# Altium project Power_Merge_Board.PrjPCB
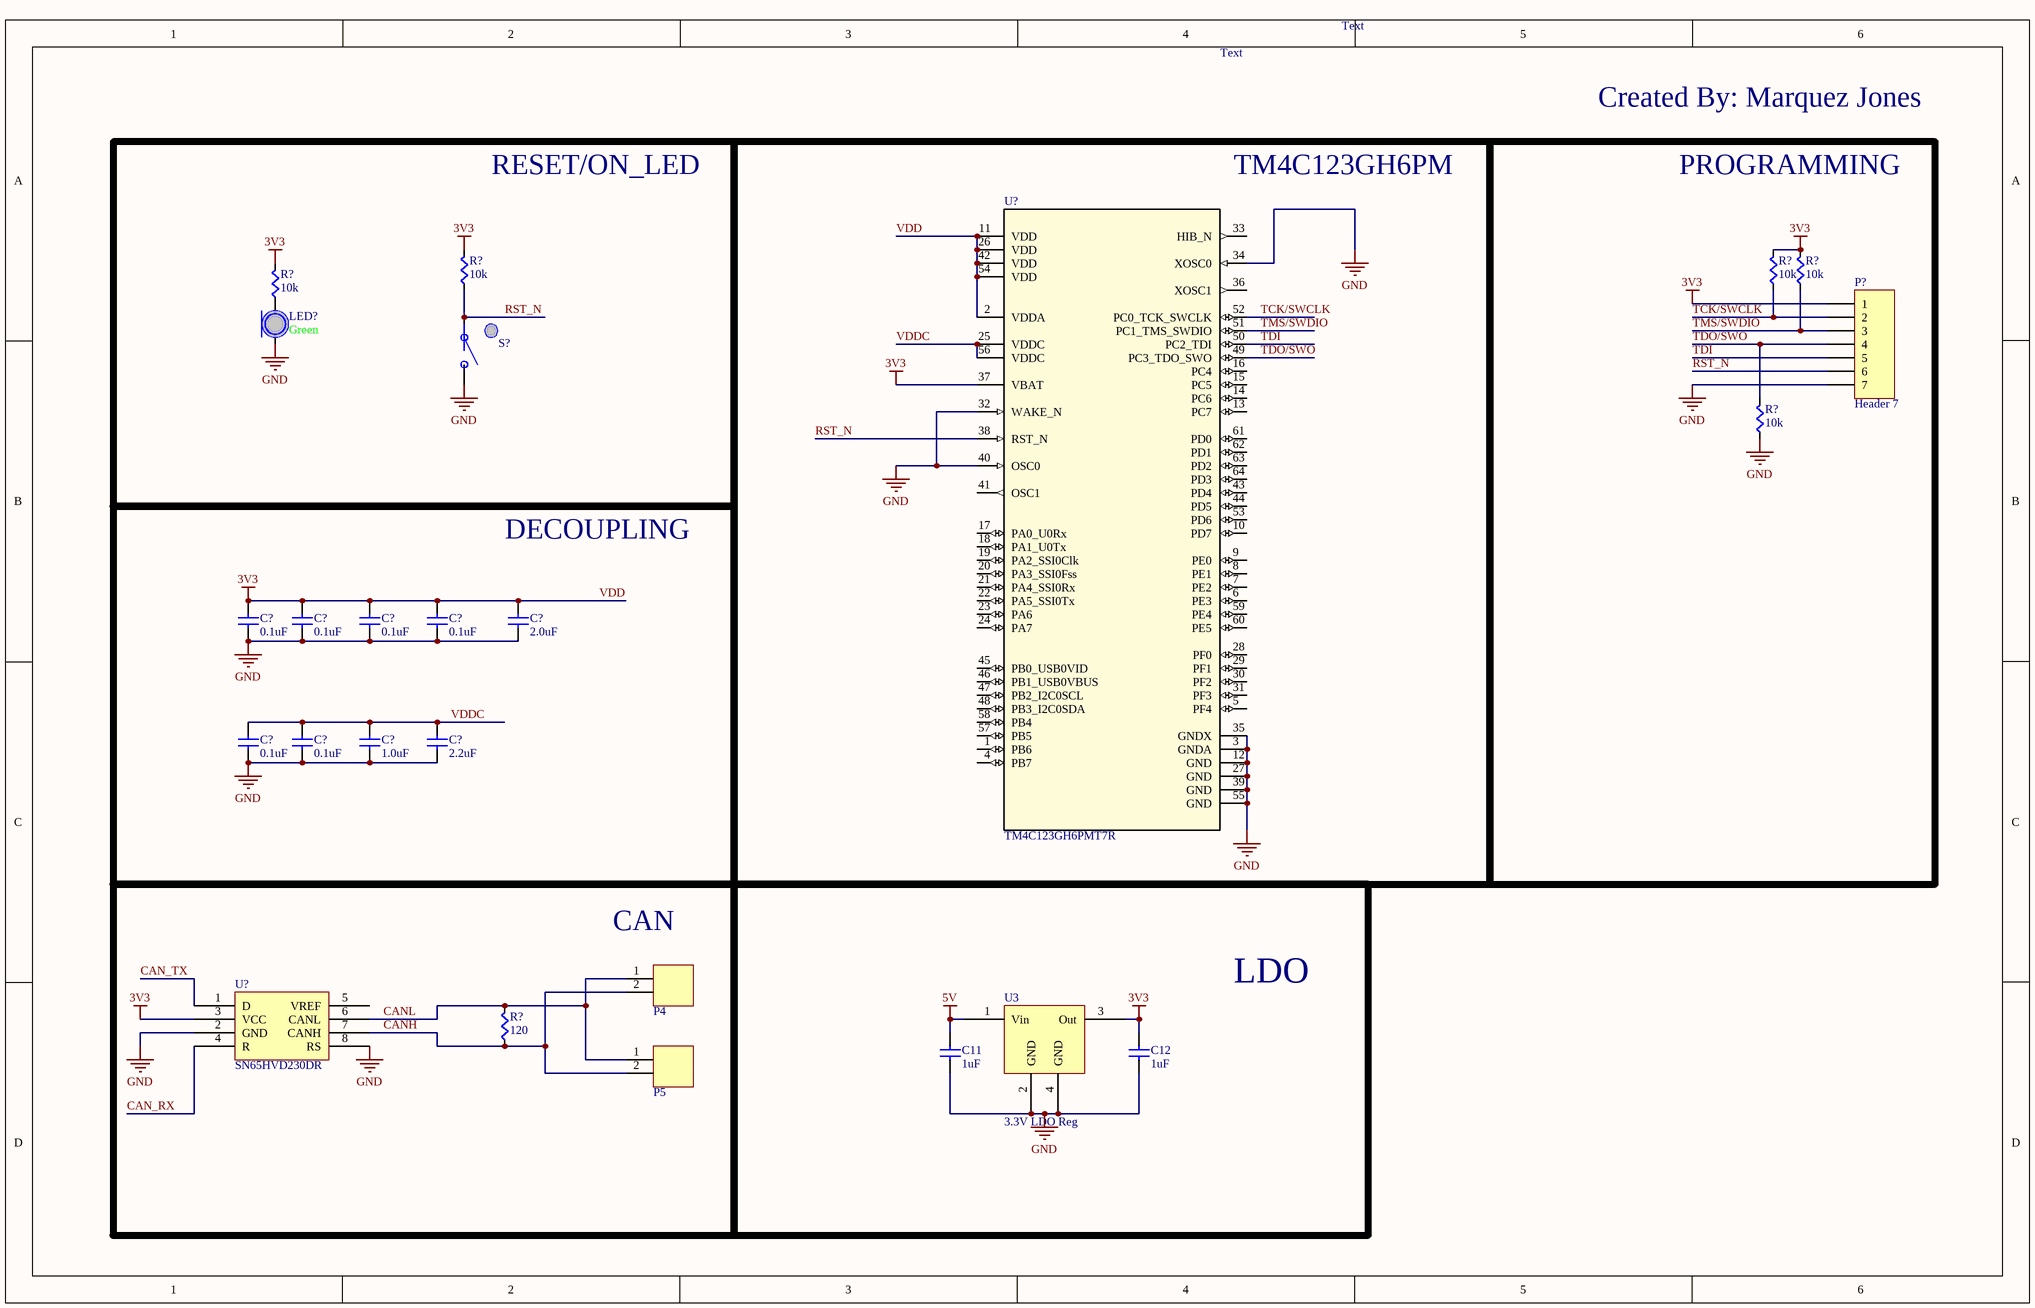
[diagram p0: Tiva_C_Base.SchDoc]
3 sheets, 56 parts. Net scope: global (net labels, ports and power ports of the same name join across sheets).
Board file: Power_Merge_Board.PcbDoc
Sheets:
  Tiva_C_Base.SchDoc
  BQ7930_Schem.SchDoc
  Power_Merge_Sys.SchDoc

## Sheet Tiva_C_Base.SchDoc
size B

### Parts
(Parts that share a designator on the sheet are numbered #1, #2 ... from top to bottom, then left to right.)
C11  value 1uF  [CAPC0603]  (hidden comment: Cap)
C12  value 1uF  [CAPC0603]  (hidden comment: Cap)
C?#1  value 0.1uF  [CAPC0603]  (hidden comment: Cap)
C?#2  value 0.1uF  [CAPC0603]  (hidden comment: Cap)
C?#3  value 0.1uF  [CAPC0603]  (hidden comment: Cap)
C?#4  value 0.1uF  [CAPC0603]  (hidden comment: Cap)
C?#5  value 2.0uF  [CAPC0603]  (hidden comment: Cap)
C?#6  value 0.1uF  [CAPC0603]  (hidden comment: Cap)
C?#7  value 0.1uF  [CAPC0603]  (hidden comment: Cap)
C?#8  value 1.0uF  [CAPC0603]  (hidden comment: Cap)
C?#9  value 2.2uF  [CAPC0603]  (hidden comment: Cap)
LED?  Color: Green  [LED0603]  (hidden comment: LED)
P4  2-pin Horz Sherlock  [MOLEX-HDR-1X2-SHERLOCK-HORZ]  (value not drawn)
P5  2-pin Horz Sherlock  [MOLEX-HDR-1X2-SHERLOCK-HORZ]  (value not drawn)
P?  Header 7  [HDR1X7]
R?#1  value 10k  [RES0603]  (hidden comment: Res)
R?#2  value 10k  [RES0603]  (hidden comment: Res)
R?#3  value 10k  [RES0603]  (hidden comment: Res)
R?#4  value 10k  [RES0603]  (hidden comment: Res)
R?#5  value 10k  [RES0603]  (hidden comment: Res)
R?#6  value 120  [RES0603]  (hidden comment: Res)
S?  Button  [PTS645xxxxSMTR92]  (value not drawn)
U3#1  3.3V LDO Reg  [SOT23-4n]
U?#1  TM4C123GH6PMT7R  [PM0064A_N]
U?#2  SN65HVD230DR  [SOIC-8pin]

### Blocks framed on the sheet
RESET/ON_LED: LED? R?#1 R?#4 S?
TM4C123GH6PM: U?#1
PROGRAMMING: P? R?#2 R?#3 R?#5
DECOUPLING: C?#1-C?#9
CAN: P4 P5 R?#6 U?#2
LDO: C11 C12 U3#1

### Nets
5V: C11.1(A) U3#1.1(Vin)
GND: C11.2(B) C12.2(B) C?#1.2(B) C?#2.2(B) C?#3.2(B) C?#4.2(B) C?#5.2(B) C?#6.2(B) C?#7.2(B) C?#8.2(B) C?#9.2(B) LED?.C P?.7 R?#5.2(B) S?.B U3#1.2(GND) U3#1.4(GND) U?#1.3(GNDA) U?#1.12(GND) U?#1.27(GND) U?#1.32(WAKE_N) U?#1.34(XOSC0) U?#1.35(GNDX) U?#1.39(GND) U?#1.40(OSC0) U?#1.55(GND) U?#2.2(GND) U?#2.8(RS)
VDD: C12.1(A) C?#1.1(A) C?#2.1(A) C?#3.1(A) C?#4.1(A) C?#5.1(A) P?.1 R?#1.1(A) R?#2.1(A) R?#3.1(A) R?#4.1(A) U3#1.3(Out) U?#1.2(VDDA) U?#1.11(VDD) U?#1.26(VDD) U?#1.37(VBAT) U?#1.42(VDD) U?#1.54(VDD) U?#2.3(VCC)  [also labelled 3V3]
CAN_RX: U?#2.4(R)
CAN_TX: U?#2.1(D)
CANH: P4.2 P5.2 R?#6.2(B) U?#2.7(CANH)
CANL: P4.1 P5.1 R?#6.1(A) U?#2.6(CANL)
RST_N: P?.6 R?#1.2(B) S?.A U?#1.38(RST_N)
TCK/SWCLK: P?.2 R?#2.2(B) U?#1.52(PC0_TCK_SWCLK)
TDI: P?.5 U?#1.50(PC2_TDI)
TDO/SWO: P?.4 R?#5.1(A) U?#1.49(PC3_TDO_SWO)
TMS/SWDIO: P?.3 R?#3.2(B) U?#1.51(PC1_TMS_SWDIO)
VDDC: C?#6.1(A) C?#7.1(A) C?#8.1(A) C?#9.1(A) U?#1.25(VDDC) U?#1.56(VDDC)
NetLED?_A: LED?.A R?#4.2(B)

Not connected (* = marked no-connect by the designer): U?#1 1(PB6) 4(PB7) 5(PF4) 6(PE3) 7(PE2) 8(PE1) 9(PE0) 10(PD7) 13(PC7) 14(PC6) 15(PC5) 16(PC4) 17(PA0_U0Rx) 18(PA1_U0Tx) 19(PA2_SSI0Clk) 20(PA3_SSI0Fss) 21(PA4_SSI0Rx) 22(PA5_SSI0Tx) 23(PA6) 24(PA7) 28(PF0) 29(PF1) 30(PF2) 31(PF3) 33(HIB_N) 36(XOSC1) 41(OSC1) 43(PD4) 44(PD5) 45(PB0_USB0VID) 46(PB1_USB0VBUS) 47(PB2_I2C0SCL) 48(PB3_I2C0SDA) 53(PD6) 57(PB5) 58(PB4) 59(PE4) 60(PE5) 61(PD0) 62(PD1) 63(PD2) 64(PD3); U?#2 5(VREF)

### Notes on the sheet
- Text
- Created By: Marquez Jones

### Library data of the parts
C11 C12 = Cap: Manufacturer Part Number: C0603C105K8PACTU; Supplier 1: Digi-Key; Supplier Part Number 1: 399-3118-1-ND
P4 P5 = MOLEX-HDR-1x2-SHERLOCK_RA: Header, Molex, 2mm Pitch Sherlock Header, Single Row, Horizontal, 2 Circuits, Length 3.3mm,  0353630260; Manufacturer: Molex Inc; Manufacturer Part Number: 0353630260; Supplier Part Number 1: WM18931-ND; Supplier 1: Digi-Key
P? = Header 7: Header, 7-Pin; LatestRevisionDate: 17-Jul-2002; LatestRevisionNote: Re-released for DXP Platform.; Publisher: Altium Limited
S? = Button: SPST Button; Supplier 1: Digi-Key; Supplier Part Number 1: CKN9087CT-ND
U3#1 = LM3940IMPX-3.3: IC REG LDO 3.3V 1A SOT223; Supplier 1: Digi-Key; Supplier Part Number 1: LM3940IMPX-3.3/NOPBCT-ND
U?#1 = TM4C123GH6PMT7R: Imported; PartNumber: TM4C123GH6PMTR; Manufacturer: Texas Instruments; CompType: IC; PIN_COUNT: 64; Application_BuildNumber: *; Alternate_PartNumber: TM4C123GH6PMT; PackageReference: PM0064A; MountType: SMT; RoHS: Y; RefDes: RefDes; TYPE: TYPE; Value: Value
U?#2 = SN65HVD230DR: IC TXRX CAN 1MBPS 3.3V 8SOIC; Supplier 1: Digi-Key; Supplier Part Numbe 1: 296-11654-1-ND
C?#1-C?#9 = Cap: Supplier 1: Digi-Key; Supplier Part Number 1: 1276-1000-1-ND
LED? = LED: Supplier 1: Digi-Key; Supplier Part Number 1: 754-1122-1-ND
R?#1-R?#6 = Res: Supplier 1: Digi-Key; Supplier Part Number 1: RMCF0603JT10K0CT-ND

## Sheet BQ7930_Schem.SchDoc
size C
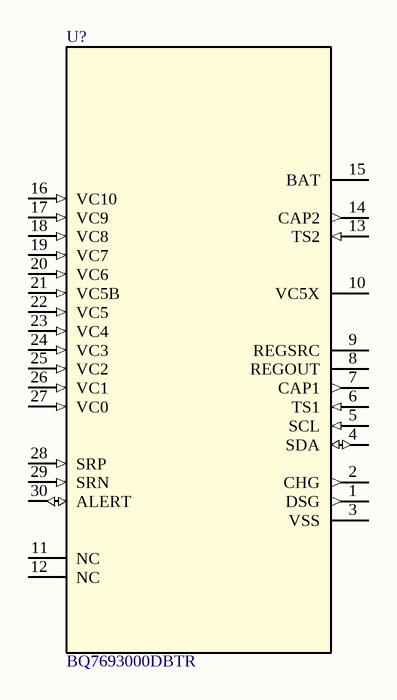
[diagram p1: BQ7930_Schem.SchDoc]

### Parts
(Parts that share a designator on the sheet are numbered #1, #2 ... from top to bottom, then left to right.)
U?#3  BQ7693000DBTR  [DBT0030A_N]

### Nets

Not connected (* = marked no-connect by the designer): U?#3 1(DSG) 2(CHG) 3(VSS) 4(SDA) 5(SCL) 6(TS1) 7(CAP1) 8(REGOUT) 9(REGSRC) 10(VC5X) 11(NC) 12(NC) 13(TS2) 14(CAP2) 15(BAT) 16(VC10) 17(VC9) 18(VC8) 19(VC7) 20(VC6) 21(VC5B) 22(VC5) 23(VC4) 24(VC3) 25(VC2) 26(VC1) 27(VC0) 28(SRP) 29(SRN) 30(ALERT)

### Library data of the parts
U?#3 = BQ7693000DBTR: Imported; Manufacturer: Texas Instruments; PartNumber: BQ7693000DBTR; RefDes: RefDes; TYPE: TYPE; Value: Value

## Sheet Power_Merge_Sys.SchDoc
size C
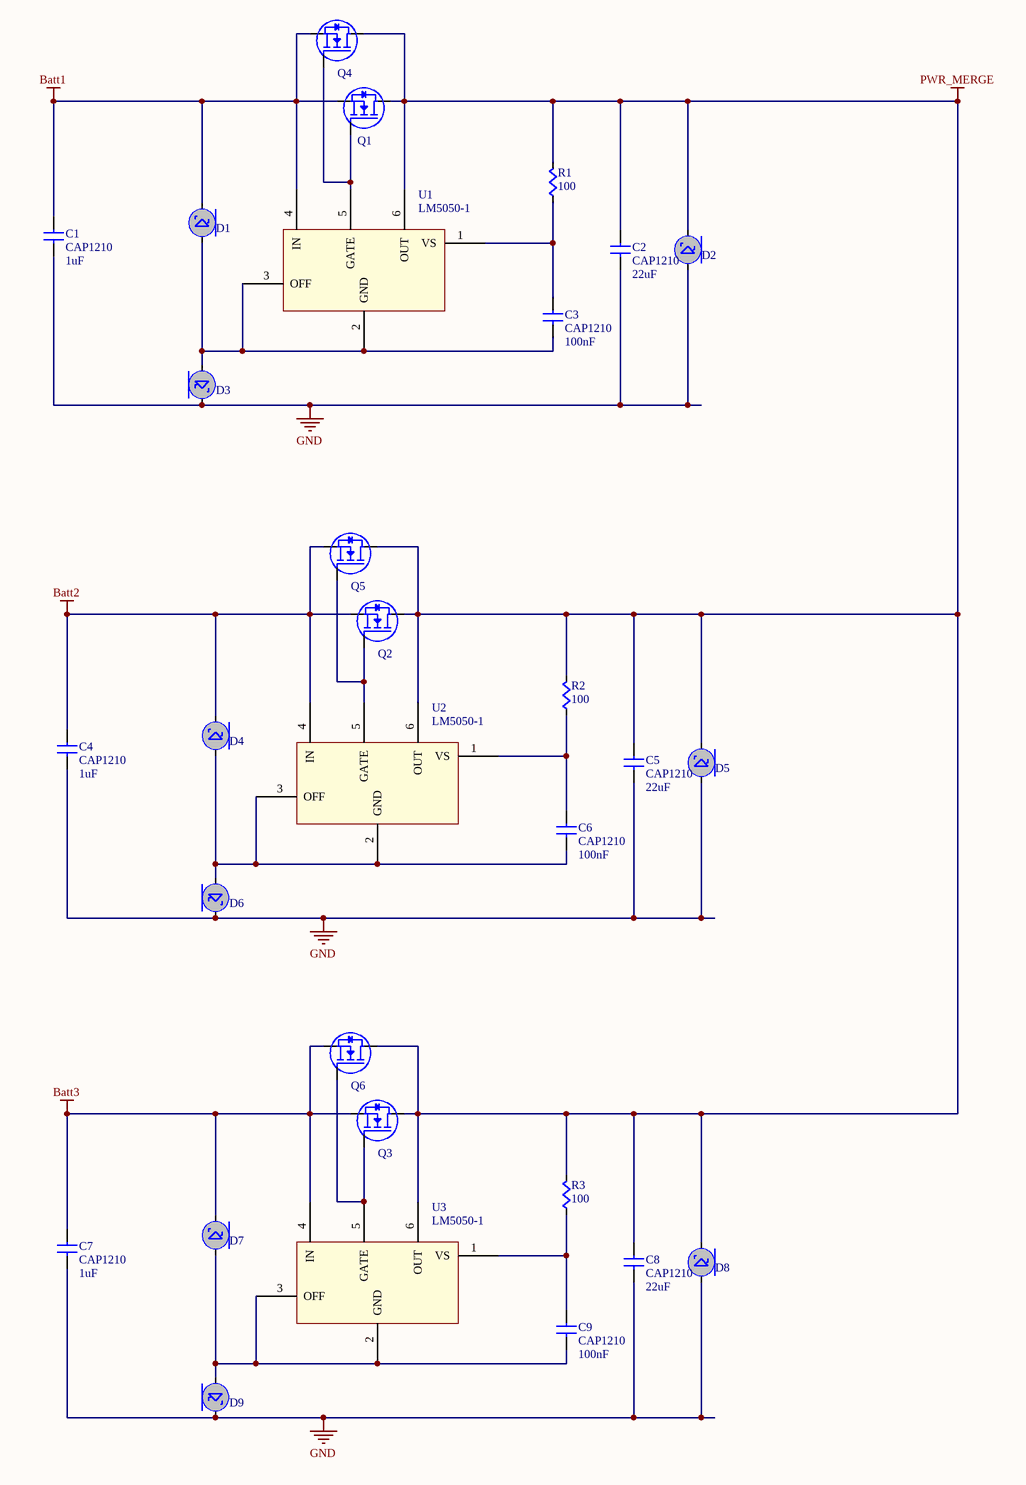
[diagram p2: Power_Merge_Sys.SchDoc]

### Parts
(Parts that share a designator on the sheet are numbered #1, #2 ... from top to bottom, then left to right.)
C1  CAP1210  value 1uF  [CAP1210]
C2  CAP1210  value 22uF  [CAP1210]
C3  CAP1210  value 100nF  [CAP1210]
C4  CAP1210  value 1uF  [CAP1210]
C5  CAP1210  value 22uF  [CAP1210]
C6  CAP1210  value 100nF  [CAP1210]
C7  CAP1210  value 1uF  [CAP1210]
C8  CAP1210  value 22uF  [CAP1210]
C9  CAP1210  value 100nF  [CAP1210]
D1  SS16T3G  [SS16T3G]  (value not drawn)
D2  SMBJ60A-13-F  [SMBJ60A-13-F]  (value not drawn)
D3  SS16T3G  [SS16T3G]  (value not drawn)
D4  SS16T3G  [SS16T3G]  (value not drawn)
D5  SMBJ60A-13-F  [SMBJ60A-13-F]  (value not drawn)
D6  SS16T3G  [SS16T3G]  (value not drawn)
D7  SS16T3G  [SS16T3G]  (value not drawn)
D8  SMBJ60A-13-F  [SMBJ60A-13-F]  (value not drawn)
D9  SS16T3G  [SS16T3G]  (value not drawn)
Q1  IRFB3306PbF  [TO-220AB Heatsink]  (value not drawn)
Q2  IRFB3306PbF  [TO-220AB Heatsink]  (value not drawn)
Q3  IRFB3306PbF  [TO-220AB Heatsink]  (value not drawn)
Q4  IRFB3306PbF  [TO-220AB Heatsink]  (value not drawn)
Q5  IRFB3306PbF  [TO-220AB Heatsink]  (value not drawn)
Q6  IRFB3306PbF  [TO-220AB Heatsink]  (value not drawn)
R1  value 100  [RES0603]  (hidden comment: Res)
R2  value 100  [RES0603]  (hidden comment: Res)
R3  value 100  [RES0603]  (hidden comment: Res)
U1  LM5050-1  [LM5050]
U2  LM5050-1  [LM5050]
U3#2  LM5050-1  [LM5050]

### Nets
Batt1: C1.1(A) D1.C Q1.S Q4.S U1.4(IN)
Batt2: C4.1(A) D4.C Q2.S Q5.S U2.4(IN)
Batt3: C7.1(A) D7.C Q3.S Q6.S U3#2.4(IN)
GND: C1.2(B) C2.2(B) C4.2(B) C5.2(B) C7.2(B) C8.2(B) D2.A D3.C D5.A D6.C D8.A D9.C
PWR_MERGE: C2.1(A) C5.1(A) C8.1(A) D2.C D5.C D8.C Q1.D Q2.D Q3.D Q4.D Q5.D Q6.D R1.1(A) R2.1(A) R3.1(A) U1.6(OUT) U2.6(OUT) U3#2.6(OUT)
NetC3_1: C3.1(A) R1.2(B) U1.1(VS)
NetC3_2: C3.2(B) D1.A D3.A U1.2(GND) U1.3(OFF)
NetC6_1: C6.1(A) R2.2(B) U2.1(VS)
NetC6_2: C6.2(B) D4.A D6.A U2.2(GND) U2.3(OFF)
NetC9_1: C9.1(A) R3.2(B) U3#2.1(VS)
NetC9_2: C9.2(B) D7.A D9.A U3#2.2(GND) U3#2.3(OFF)
NetQ1_G: Q1.G Q4.G U1.5(GATE)
NetQ2_G: Q2.G Q5.G U2.5(GATE)
NetQ3_G: Q3.G Q6.G U3#2.5(GATE)

### Library data of the parts
C1-C9 = CAP1210: CAP CER 10UF 50V 20% X5R 1210; Supplier 1: Digi-Key; Supplier Part Number 1: 587-2225-1-ND
D1 D3 D4 D6 D7 D9 = SS16T3G: DIODE SCHOTTKY 60V 1A SMA; Supplier 1: Digi-Key; Supplier Part Number 1: SS16T3GOSDKR-ND
D2 D5 D8 = SMBJ60A-13-F: TVS UNIDIRECT 600W 60V SMB; Supplier 1: Digi-Key; Supplier Part Number 1: SMBJ60A-FDIDKR-ND
Q1-Q6 = IRFx3306PbF: HEXFET Power MOSFET; Heatsink: A10755-ND; Supplier 1: Digi-Key; Supplier Part Number 1: IRFB3306PBF-ND
U1 U2 U3#2 = LM5050: High-Side OR-ing FET Controller; Supplier 1: Digi-Key; Supplier Part Number 1: LM5050MK-1/NOPBCT-ND
R1-R3 = Res: Supplier 1: Digi-Key; Supplier Part Number 1: RMCF0603JT10K0CT-ND

## Nets that join several sheets
GND: Tiva_C_Base (28 pins), Power_Merge_Sys (12 pins)